# EAGLE design socket-v2-high-voltage (EAGLE 6.6.0)
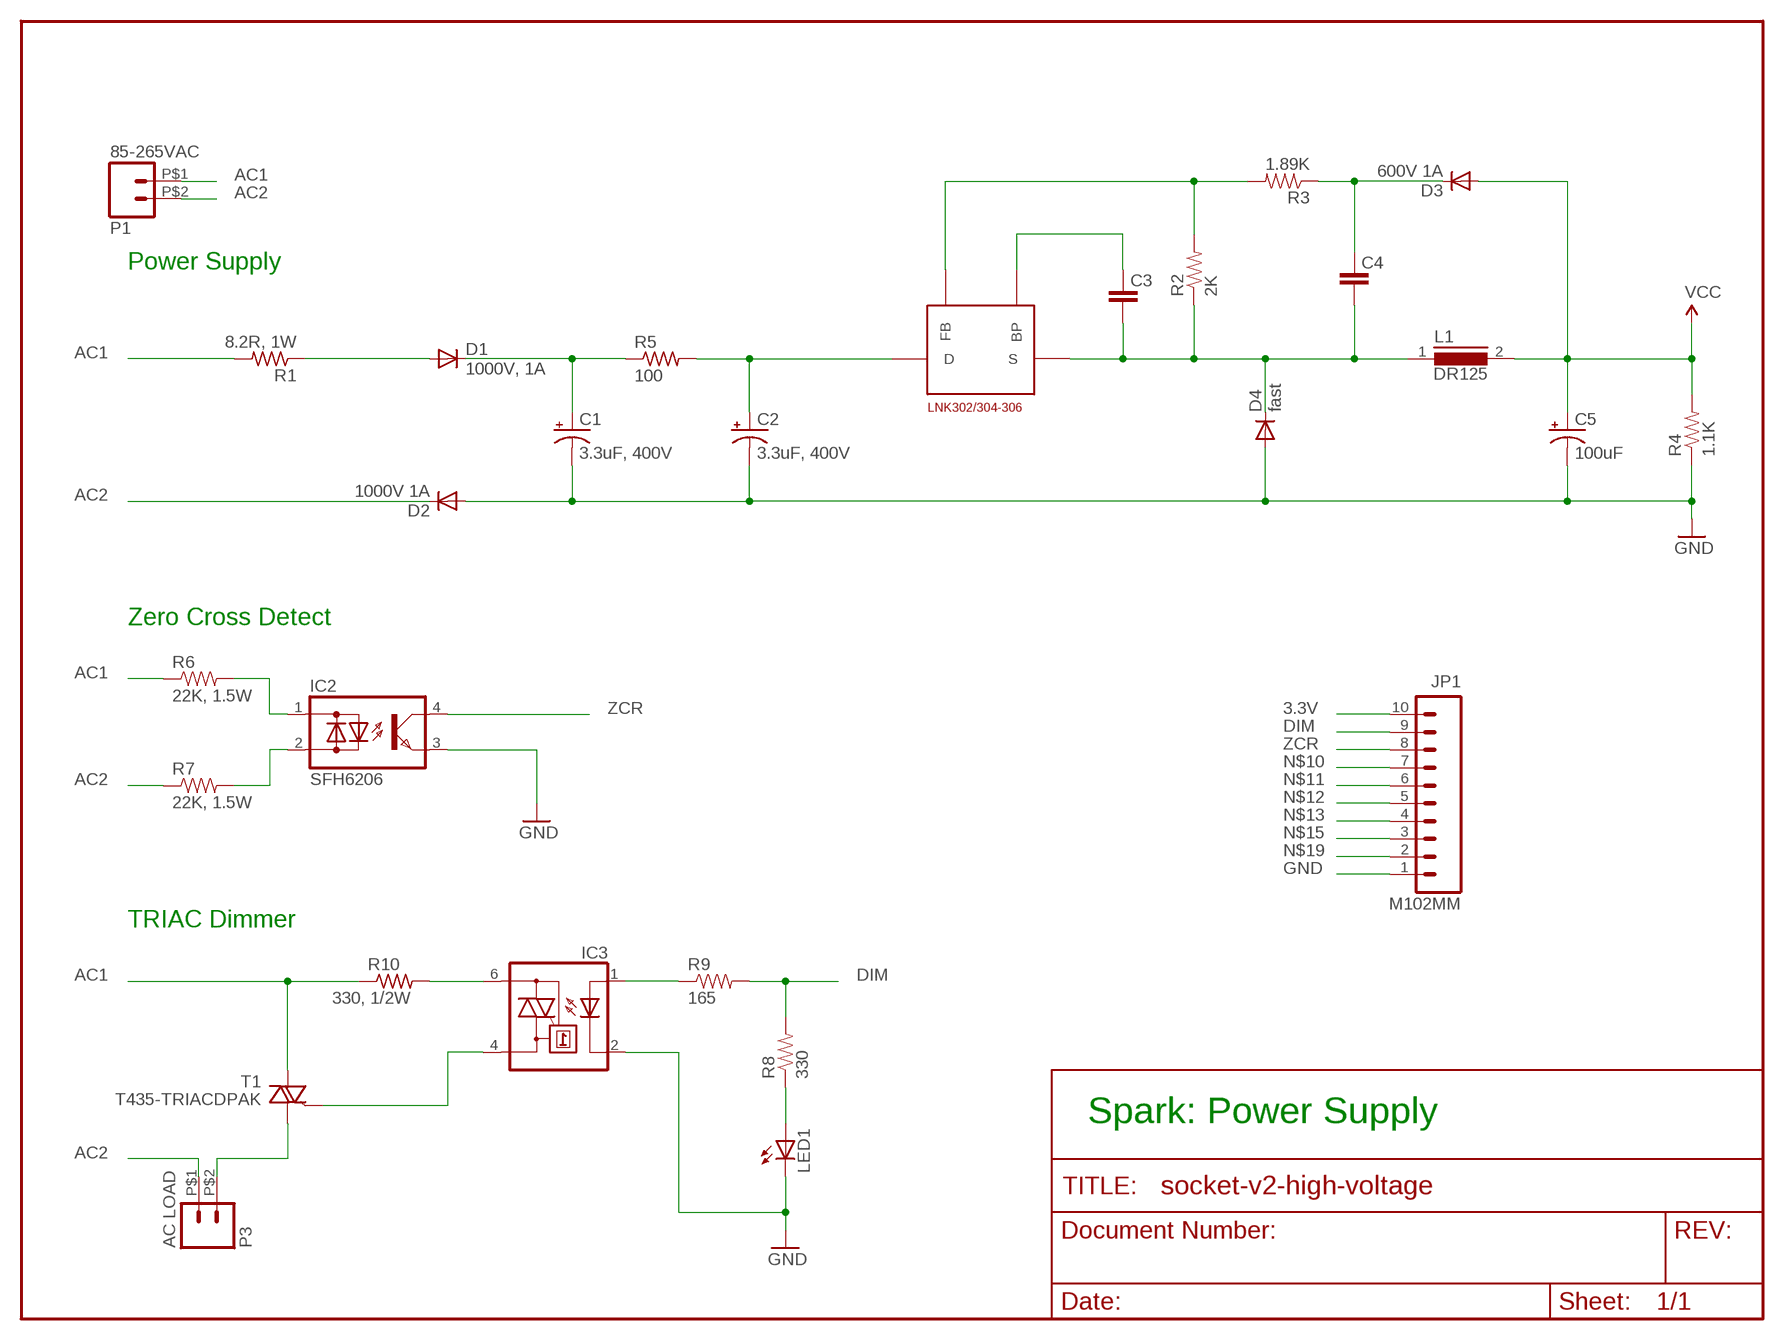
[diagram p0: schematic, sheet 1]

## Parts
C1  3.3uF, 400V  CPOL-USE3.5-8  [E3,5-8]
C2  3.3uF, 400V  CPOL-USE3.5-8  [E3,5-8]
C3  0.1uF  CAP0603-CAP  [0603-CAP]
C4  10uF, 50V  CAP0805  [0805]
C5  100uF  CAP_POL3528  [EIA3528]
D1  1000V, 1A  DIODESMA  [SMA-DIODE]
D2  1000V 1A  DIODESMA  [SMA-DIODE]
D3  600V 1A  DIODESMA  [SMA-DIODE]
D4  fast  DIODESMA  [SMA-DIODE]
IC1  LNK302/304-306  [SMD-8B]
IC2  SFH6206  [DIL4-SMD]
IC3  MOC3031S  [DIL6-SMD]
JP1  M102MM  [1X10-2MM]
L1  DR125  [DR125]
LED1  LED0603  [LED-0603]
P1  85-265VAC  M02PTH2  [1X02_BIG]
P3  AC LOAD  M02PTH2  [1X02_BIG]
R1  8.2R, 1W  R-US_0207/10  [0207/10]
R2  2K  RESISTOR0805-RES  [0805]
R3  1.89K  RESISTOR0805-RES  [0805]
R4  1.1K  RESISTOR0603-RES  [0603-RES]
R5  100  R-US_0204/7  [0204/7]
R6  22K, 1.5W  RESISTOR2512  [R2512]
R7  22K, 1.5W  RESISTOR2512  [R2512]
R8  330  RESISTOR0805-RES  [0805]
R9  165  RESISTOR0805-RES  [0805]
R10  330, 1/2W  R-US_R1210  [R1210]
T1  T435-TRIACDPAK  [TO252]

## Nets
3.3V: C5.A(+) D3.A JP1.10 L1.2 R4.2 ; supply symbol labelled VCC
$N$100: C3.1 C4.1 D4.C IC1.S1(S) L1.1 R2.1
$N$101: C2.+ IC1.D R5.2
AC1: P1.P$1 R1.2 R6.1 R10.1 T1.2(A2)
AC2: D2.C P1.P$2 P3.P$1 R7.1
DIM: JP1.9 R8.2 R9.2
GND: C1.- C2.- C5.C(-) D2.A D4.A IC2.3(E) IC3.2(C) JP1.1 LED1.C R4.1
N$2: C4.2 D3.C R3.1
N$3: C3.2 IC1.BP
N$4: IC3.1(A) R9.1
N$5: IC3.6(A2) R10.2
N$6: IC3.4(A1) T1.3(G)
N$9: P3.P$2 T1.1(A1)
N$10: JP1.7
N$11: JP1.6
N$12: JP1.5
N$13: JP1.4
N$14: IC2.1(AC1) R6.2
N$15: JP1.3
N$16: LED1.A R8.1
N$17: C1.+ D1.C R5.1
N$18: IC1.FB R2.2 R3.2
N$19: JP1.2
N$26: IC2.2(AC2) R7.2
RAW_PR: D1.A R1.1
ZCR: IC2.4(C) JP1.8

## Notes on the sheet
- Power Supply
- Zero Cross Detect
- TRIAC Dimmer
- Spark: Power Supply

## Library data of the parts
C1 C2 = adafruit:CPOL-US: POLARIZED CAPACITOR, American symbol
C3 C4 = SparkFun:CAP: Capacitor Standard 0603 ceramic capacitor, and 0.1" leaded capacitor.
C5 = SparkFun:CAP_POL: Capacitor Polarized These are standard SMD and PTH capacitors. Normally 10uF, 47uF, and 100uF in electrolytic and tantalum varieties. Always verify the external diameter of the through hole cap, it varies with capacity, voltage, and manufacturer. The EIA devices should be standard.
D1-D4 = SparkFun:DIODE: Diode These are standard reverse protection diodes and small signal diodes. SMA package can handle up to about 1A. SOD-323 can handle about 200mA. What the SOD-323 package when ordering, there are some mfgs out there that are 5-pin packages.
IC1 = linkswitch:LNK302/304-306
IC2 = optocoupler:SFH620: Optocoupler, Phototransistor Output, AC Input Source: http://www.vishay.com/docs/83675/sfh620.pdf; MF: VISHAY/TELEFUNKEN; MPN: SFH6206-3; OC_FARNELL: 1469585; OC_NEWARK: 58K2214
IC3 = optocoupler:MOC30*: 6-Pin DIP Zero-Cross Optoisolators Triac Driver Output (250/400 Volt Peak) Source: http://www.fairchildsemi.com/ds/MO/MOC3043-M.pdf; MF: FAIRCHILD SEMICONDUCTOR; MPN: MOC3031SM; OC_FARNELL: unknown; OC_NEWARK: 34C1335
JP1 = SparkFun:M10: Header 10 Standard 10-pin 0.1" header. Use with straight break away headers (SKU : PRT-00116), right angle break away headers (PRT-00553), swiss pins (PRT-00743), machine pins (PRT-00117), and female headers (PRT-00115).
L1 = inductors:DR125: High Power Density, High Efficiency, Shielded Inductors Source: coiltronics_dr_series.pdf
LED1 = SparkFun:LED: LEDs Standard schematic elements and footprints for 5mm, 3mm, 1206, and 0603 sized LEDs. 5mm - Spark Fun Electronics SKU : COM-00529 (and others)
P1 P3 = SparkFun:M02: Header 2 Standard 2-pin 0.1" header. Use with straight break away headers (SKU : PRT-00116), right angle break away headers (PRT-00553), swiss pins (PRT-00743), machine pins (PRT-00117), and female headers (PRT-00115). Molex polarized connector foot print use with SKU : PRT-08233 with associated crimp pins and housings.
R1 R5 R10 = adafruit:R-US_: RESISTOR, American symbol
R2-R4 R6-R9 = SparkFun:RESISTOR: Resistor Basic schematic elements and footprints for 0603, 1206, and PTH resistors.
T1 = Spark-3:T435-TRIAC

## Net classes
2 gnd: width 0.203 mm, drill 0.559 mm, clearance 0.152 mm
3 usbvcc: width 0.203 mm, drill 0.61 mm, clearance 0.152 mm
4 aref: width 0.203 mm, drill 0.61 mm, clearance 0.152 mm

## Board
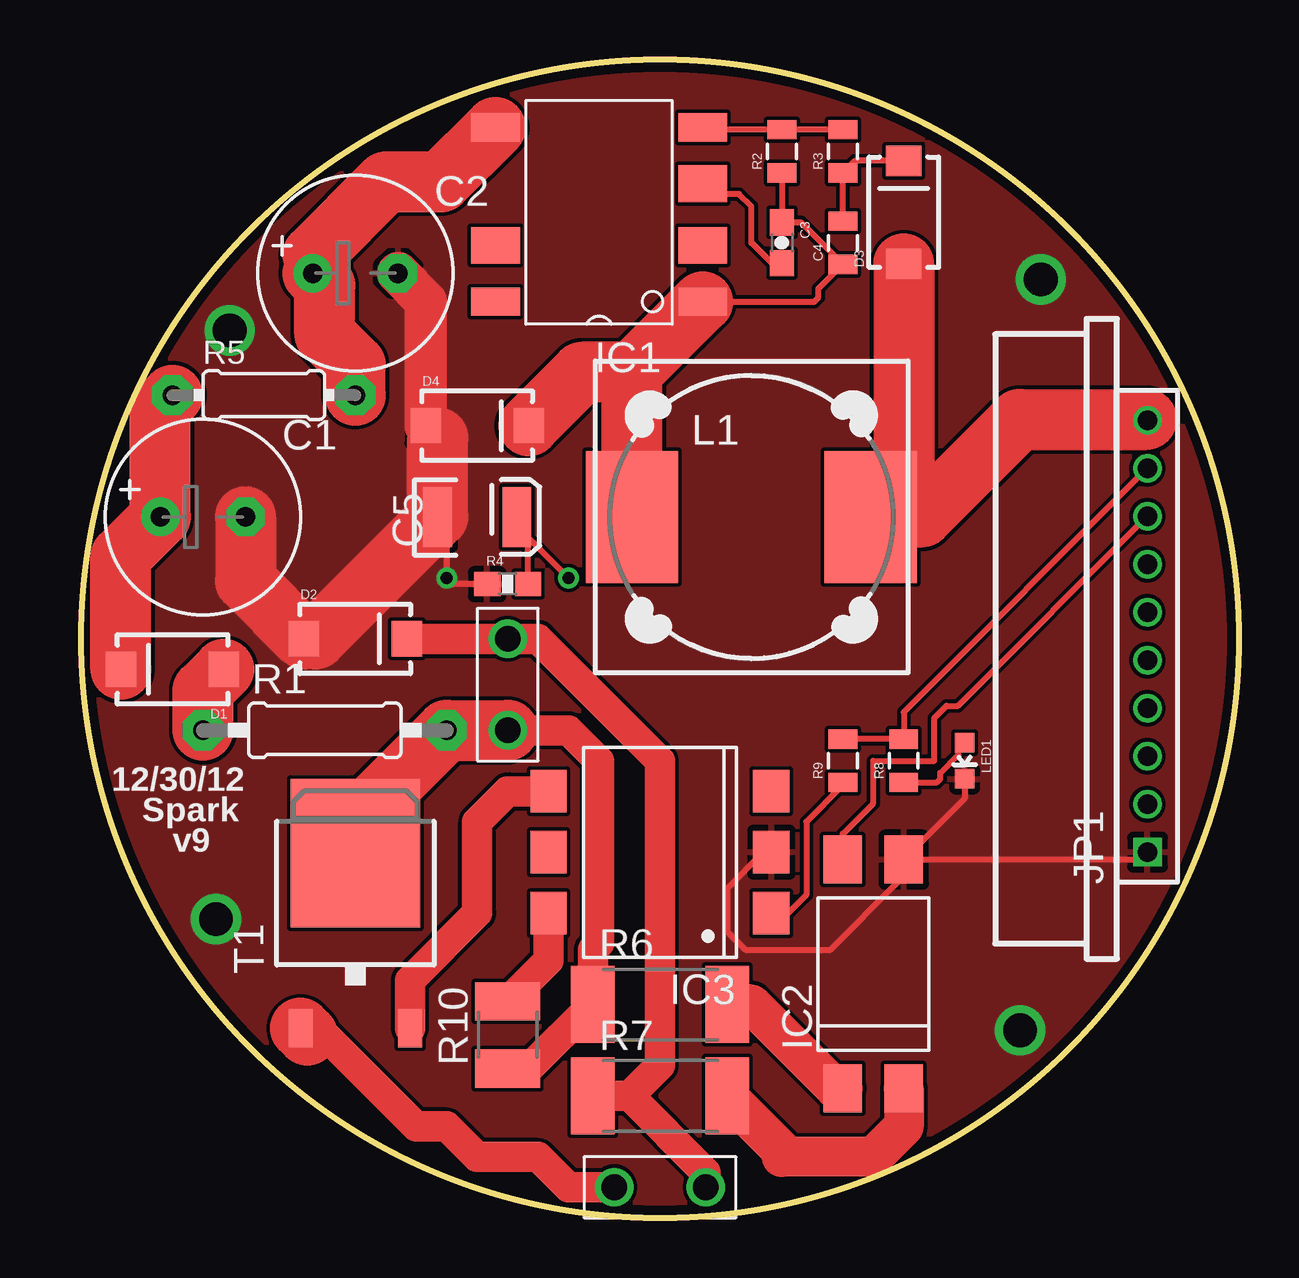
[diagram p1: board, top side]
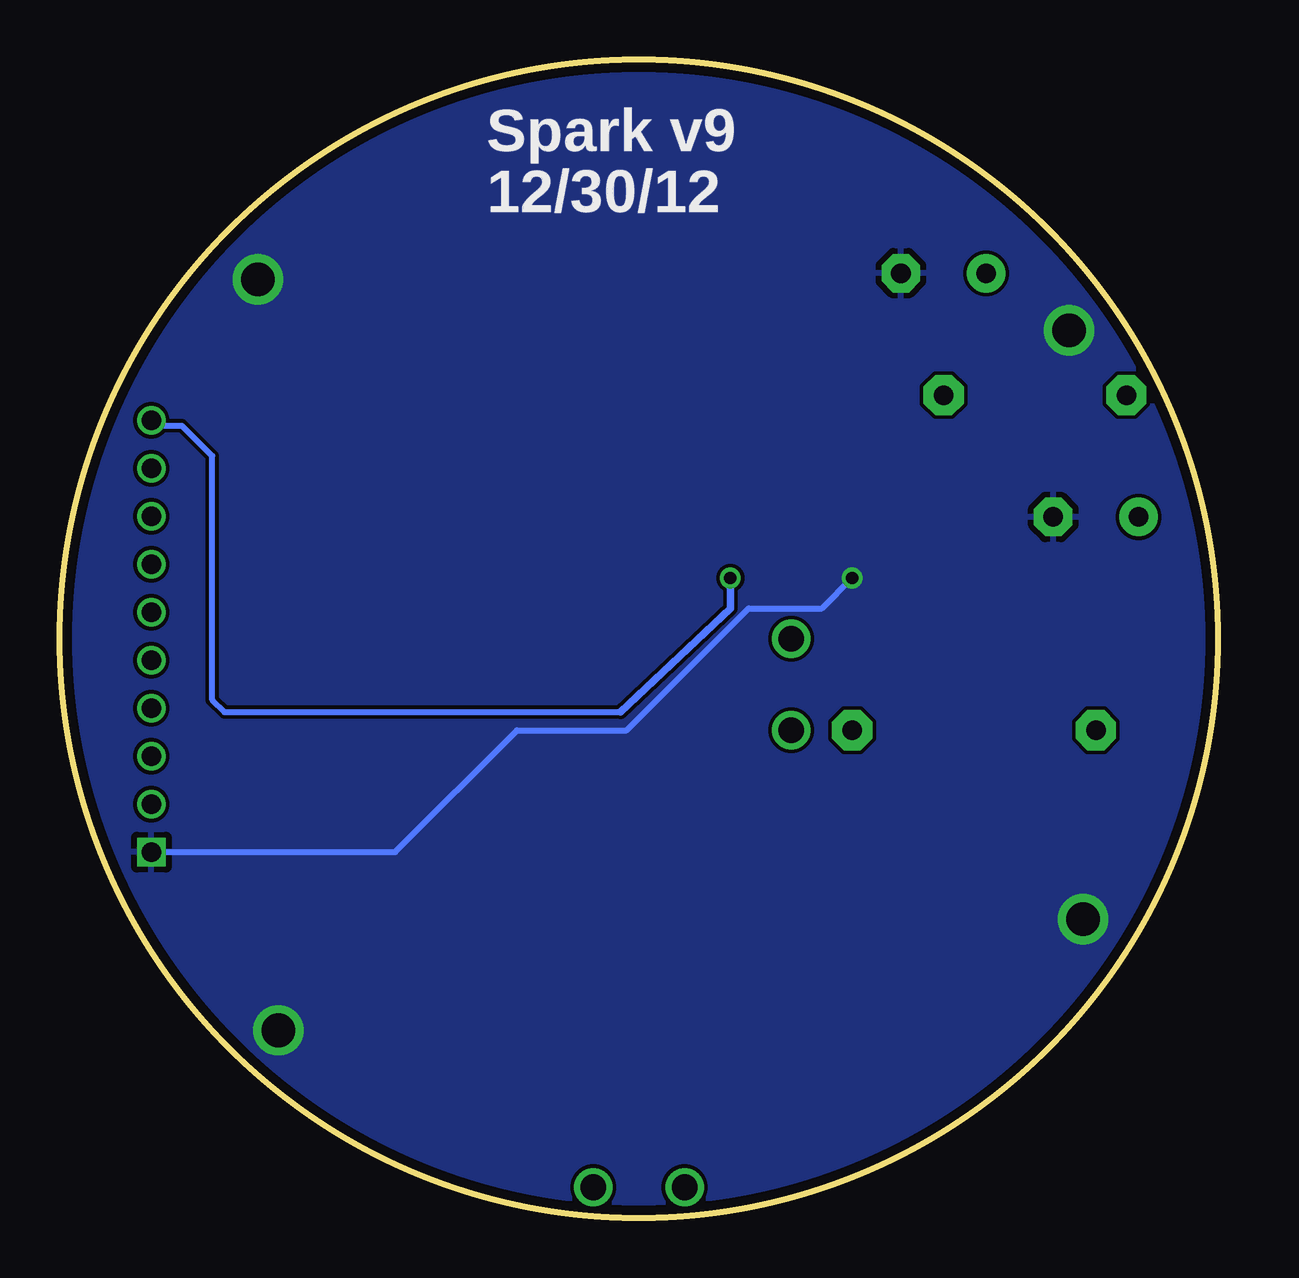
[diagram p2: board, bottom side, seen from below]

Size 48.26 x 48.26 mm. Coordinates in mm from the lower left corner, seen from the top.
Outline: circle at 24.13,24.13 radius 24.13
Copper layers (1*16): Top 0.0356mm / dielectric 1.5011mm / Bottom 0.0356mm
Design rules "default": minimum track width 6mil, minimum drill 13mil, track to track 6mil, track to pad 6mil, pad to pad 6mil, via to via 6mil, smd to smd 6mil, copper to edge 15mil, drill to drill 6mil, minimum pad ring 7mil, minimum via ring 7mil, stop-mask expansion 4mil, vias tented up to drill 0mil, thermal gap 10mil

### Footprints (pad centres in the part's own frame; a part is rotated, then mirrored left to right if it is on the bottom)
E3,5-8 = drill 0.813 pad 1.6: + -1.778,0 | drill 0.813 pad 1.6 octagon: - 1.778,0
0603-CAP = smd 1.1 x 1: 1 -0.85,0; 2 0.85,0
0805 = smd 0.8 x 1.2: 1 -0.9,0; 2 0.9,0
EIA3528 = smd 1.2 x 2.5: A 1.65,0; C -1.65,0
SMA-DIODE = smd 1.27 x 1.47: A -2.15,0; C 2.15,0
SMD-8B = smd 2.032 x 1.524: BP -4.318,-1.194; S2 -4.318,1.372; S3 4.318,1.372 | smd 2.032 x 1.168: D 4.318,-3.537; FB -4.318,-3.537; S1 -4.318,3.728; S4 4.318,3.728
DIL4-SMD = smd 1.6 x 2: 1 -1.27,-4.77; 2 1.27,-4.77; 3 1.27,4.77; 4 -1.27,4.77
DIL6-SMD = smd 1.78 x 1.52: 1 -2.54,-4.645; 2 0,-4.645; 3 2.54,-4.645; 4 2.54,4.645; 5 0,4.645; 6 -2.54,4.645
1X10-2MM = drill 0.8 square: 1 0,0 | drill 0.8: 2 2,0; 3 4,0; 4 6,0; 5 8,0; 6 10,0; 7 12,0; 8 14,0; 9 16,0; 10 18,0
DR125 = smd 3.85 x 5.5: 1 -4.975,0; 2 4.975,0
LED-0603 = smd 0.8 x 0.8: A 0,-0.75; C 0,0.75
1X02_BIG = drill 1.067: P$1 0,0; P$2 3.81,0
0207/10 = drill 0.813 pad 1.676 octagon: 1 -5.08,0; 2 5.08,0
0603-RES = smd 1.1 x 1: 1 -0.85,0; 2 0.85,0
0204/7 = drill 0.813 pad 1.676 octagon: 1 -3.81,0; 2 3.81,0
R2512 = smd 1.8 x 3.2: 1 -2.8,0; 2 2.8,0
R1210 = smd 1.6 x 2.7: 1 -1.4,0; 2 1.4,0
TO252 = smd 1 x 1.6: 1 -2.28,-4.8; 3 2.28,-4.8 | smd 5.4 x 6.2: 2 0,2.5

### Placement (x,y rotation side)
C1  5.08,29.21 0 top
C2  11.43,39.37 0 top
C3  29.21,40.64 270 top
C4  31.75,40.64 90 top
C5  16.51,29.21 0 top
D1  3.81,22.86 180 top
D2  11.43,24.13 0 top
D3  34.29,41.91 90 top
D4  16.51,33.02 0 top
IC1  21.59,41.91 180 top
IC2  33.02,10.16 0 top
IC3  24.13,15.24 90 top
JP1  44.45,15.24 90 top
L1  27.94,29.21 0 top
LED1  36.83,19.05 180 top
P1  17.78,20.32 90 top
P3  26.04,1.27 180 top
R1  10.16,20.32 0 top
R2  29.21,44.45 90 top
R3  31.75,44.45 90 top
R4  17.78,26.42 0 top
R5  7.62,34.29 0 top
R6  24.13,8.89 0 top
R7  24.13,5.08 0 top
R8  34.29,19.05 90 top
R9  31.75,19.05 90 top
R10  17.78,7.62 90 top
T1  11.43,12.7 0 top

### Tracks (layer width: path | path; a pad name or v marks a point on that pad's centre or on a via)
3.3V  (via drill 0.51)
  Top 0.254: v20.32,26.67 18.63,28.36 | 18.63,28.36 17.78,29.21 C5.A | R4.2 18.63,28.36
  Top 1.27: 34.29,30.59 L1.2 | 44.42,33.27 JP1.10
  Top 2.54: D3.A 34.29,30.59 | L1.2 35.05,29.21 39.12,33.27 44.42,33.27
  Bottom 0.254: JP1.10 44.45,33.02 43.18,33.02 41.91,31.75 41.91,21.59 41.4,21.08 24.89,21.08
  Bottom 0.305: 24.89,21.08 20.32,25.4 v20.32,26.67
$N$100
  Top 0.254: R2.1 C3.1 30,41.49 C4.1 30.73,38.72 30.73,38.35 30.56,38.18 IC1.S1
  Top 2.54: L1.1 22.96,35.24 | 22.96,35.24 IC1.S1 | 22.96,35.24 20.88,35.24 D4.C
$N$101
  Top 1.27: C2.+ 9.65,40.13
  Top 2.54: R5.2 11.43,35.56 10.16,36.83 10.16,38.86 C2.+ | 9.65,40.13 12.7,43.18 15.01,43.18 IC1.D
AC1
  Top 0.152: T1.2 11.68,15.24 11.68,15.75 11.43,16.51
  Top 1.27: P1.P$1 20.32,20.32 21.59,19.05 21.59,11.43 21.33,11.17 R6.1 18.66,6.22 R10.1
  Top 2.54: P1.P$1 R1.2 11.43,16.51
AC2
  Top 1.27: R7.1 22.86,5.08 | 22.86,5.08 24.13,6.35 24.13,19.05 19.05,24.13 P1.P$2 D2.C | P3.P$1 26.04,1.91 22.86,5.08
DIM
  Top 0.254: JP1.9 34.29,21.08 R8.2 R9.2
GND  (via drill 0.51, 1.4)
  Top 0.254: C5.C 15.24,29.21 v15.24,26.67 15.49,26.42 R4.1 | LED1.C 36.83,17.47 IC2.3 | IC2.3 44.14,14.93 JP1.1 | IC3.2 28.45,15.24 26.92,13.72 26.92,11.94 27.69,11.18 31.24,11.18 34.04,13.97 34.04,14.68 IC2.3
  Top 1.27: D2.A 9.78,24.13
  Top 1.778: 14.86,32.52 D4.A 14.36,38.22 C2.-
  Top 2.54: C1.- 6.86,26.55 D2.A | 9.78,24.13 C5.C 14.86,32.52
  Bottom 0.254: JP1.1 34.29,15.24 29.21,20.32 24.64,20.32 19.56,25.4 16.51,25.4 v15.24,26.67
  other vias: 5.62,12.45 6.19,36.99 40.01,39.12 39.15,7.81
  pour Bottom: -2.32,50.51 50.45,50.51 50.45,-0.44 -2.32,-0.44
  pour Top: -1.46,48.9 50.45,48.9 50.45,-1.11 -1.52,-1.11 -1.52,48.86
N$2
  Top 0.254: D3.C 32.26,44.06 R3.1 C4.2
N$3
  Top 0.254: C3.2 28.79,39.79 27.94,40.64 27.94,42.16 27.43,42.67 26.34,42.67 IC1.BP
N$4
  Top 0.254: R9.1 31.75,18.03 30.23,16.51 30.23,13.46 28.96,12.19 28.96,12.52 IC3.1
N$5
  Top 1.27: IC3.6 19.48,10.72 R10.2
N$6
  Top 1.27: T1.3 13.71,9.9 16.51,12.7 16.51,16.51 17.78,17.78 IC3.4
N$9
  Top 1.27: P3.P$2 20.32,1.27 19.05,2.54 16.51,2.54 15.24,3.81 13.97,3.81 10.16,7.62 9.43,7.62
  Top 2.54: 9.43,7.62 T1.1
N$14
  Top 1.676: IC2.1 31.44,5.39 27.94,8.89 R6.2
N$16
  Top 0.254: R8.1 35.68,18.15 35.81,18.29 35.81,18.54 36.58,19.3 36.58,19.55 LED1.A
N$17
  Top 2.54: D1.C 1.66,27.57 C1.+ 3.3,33.78 R5.1
N$18
  Top 0.254: R3.2 R2.2 26,45.35 IC1.FB
N$26
  Top 1.676: IC2.2 34.29,3.81 33.02,2.54 29.21,2.54 29.21,2.8 R7.2
RAW_PR
  Top 2.54: R1.1 5.08,21.98 D1.A
ZCR
  Top 0.254: IC2.4 31.75,16 33.02,17.27 33.02,19.05 35.56,19.05 35.56,20.83 36.07,21.34 36.55,21.34 JP1.8

### Text on the board
tPlace: 12/30/12 | Spark | v9
bPlace: Spark v9 | 12/30/12